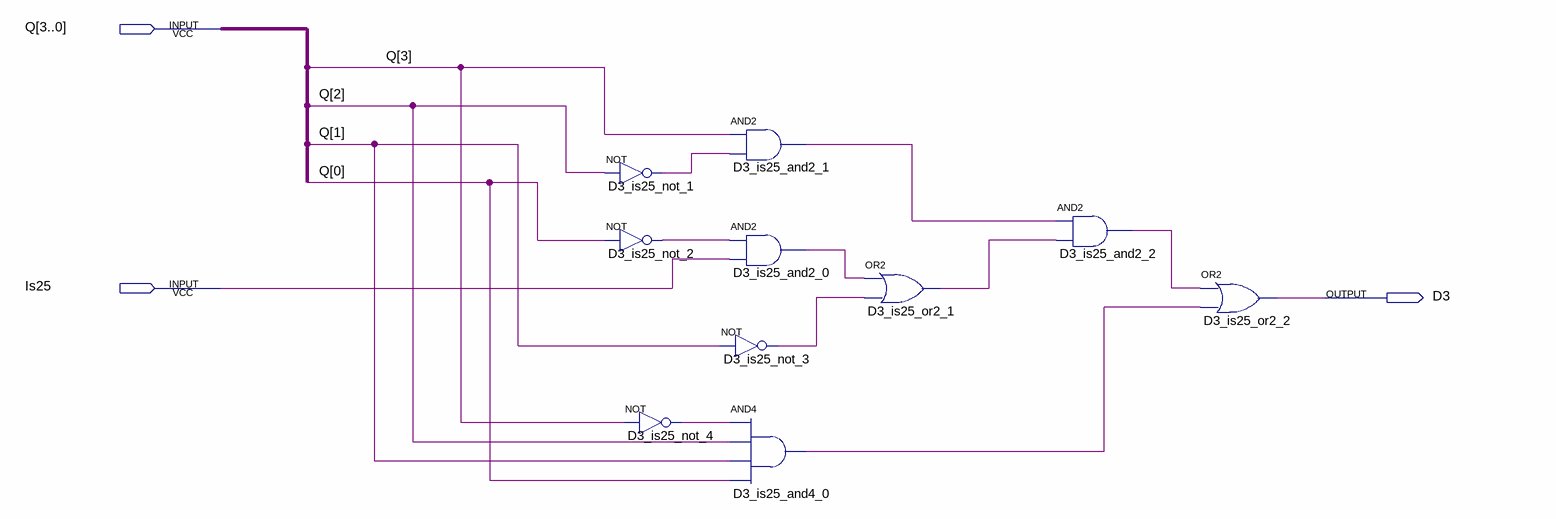
[diagram p0: schematic sheet]
// Quartus schematic D3.bdf as structural Verilog: 10 symbols, 3 pins
module D3 (
  input  [3:0] Q,
  input  Is25,
  output D3
);

  wire D3_is25_and2_0_out, D3_is25_and2_1_out, D3_is25_and2_2_out, D3_is25_and4_0_out, D3_is25_not_1_out,
       D3_is25_not_2_out, D3_is25_not_3_out, D3_is25_not_4_out, D3_is25_or2_1_out;

  not D3_is25_not_1 (D3_is25_not_1_out, Q[2]);
  not D3_is25_not_2 (D3_is25_not_2_out, Q[0]);
  not D3_is25_not_4 (D3_is25_not_4_out, Q[3]);
  and D3_is25_and2_1 (D3_is25_and2_1_out, Q[3], D3_is25_not_1_out);
  and D3_is25_and2_0 (D3_is25_and2_0_out, D3_is25_not_2_out, Is25);
  not D3_is25_not_3 (D3_is25_not_3_out, Q[1]);
  and D3_is25_and4_0 (D3_is25_and4_0_out, D3_is25_not_4_out, Q[2], Q[1], Q[0]);
  or D3_is25_or2_1 (D3_is25_or2_1_out, D3_is25_and2_0_out, D3_is25_not_3_out);
  and D3_is25_and2_2 (D3_is25_and2_2_out, D3_is25_and2_1_out, D3_is25_or2_1_out);
  or D3_is25_or2_2 (D3, D3_is25_and2_2_out, D3_is25_and4_0_out);
endmodule
